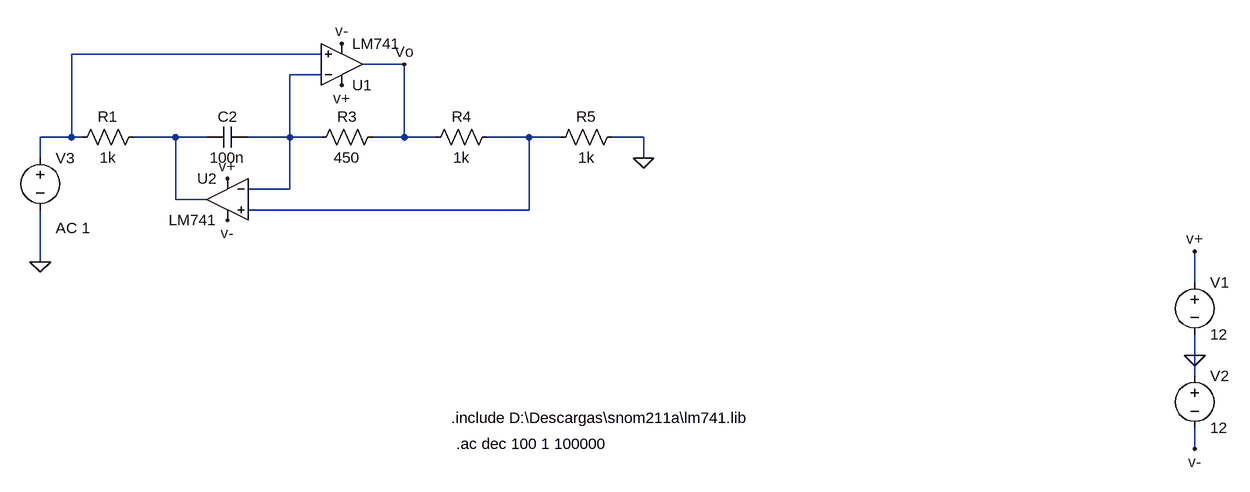
[diagram p0: schematic TS3_gic.asc]
TS3_gic.asc, the LTspice schematic file:
Version 4
SHEET 1 880 680
WIRE -1568 -496 -1952 -496
WIRE -1440 -480 -1504 -480
WIRE -1568 -464 -1616 -464
WIRE -1952 -368 -1952 -496
WIRE -1952 -368 -2000 -368
WIRE -1936 -368 -1952 -368
WIRE -1792 -368 -1856 -368
WIRE -1744 -368 -1792 -368
WIRE -1616 -368 -1616 -464
WIRE -1616 -368 -1680 -368
WIRE -1568 -368 -1616 -368
WIRE -1440 -368 -1440 -480
WIRE -1440 -368 -1488 -368
WIRE -1392 -368 -1440 -368
WIRE -1248 -368 -1312 -368
WIRE -1200 -368 -1248 -368
WIRE -1072 -368 -1120 -368
WIRE -2000 -336 -2000 -368
WIRE -1072 -336 -1072 -368
WIRE -1616 -288 -1616 -368
WIRE -1616 -288 -1680 -288
WIRE -1792 -272 -1792 -368
WIRE -1744 -272 -1792 -272
WIRE -1248 -256 -1248 -368
WIRE -1248 -256 -1680 -256
WIRE -2000 -176 -2000 -256
WIRE -224 -144 -224 -192
WIRE -224 -32 -224 -64
WIRE -224 0 -224 -32
WIRE -224 112 -224 80
FLAG -224 -32 0
FLAG -224 -192 v+
FLAG -224 112 v-
FLAG -1536 -448 v+
FLAG -1536 -512 v-
FLAG -1440 -480 Vo
FLAG -1712 -304 v+
FLAG -1712 -240 v-
FLAG -1072 -336 0
FLAG -2000 -176 0
SYMBOL voltage -224 -160 R0
WINDOW 123 0 0 Left 0
WINDOW 39 0 0 Left 0
SYMATTR InstName V1
SYMATTR Value 12
SYMBOL voltage -224 -16 R0
WINDOW 123 0 0 Left 0
WINDOW 39 0 0 Left 0
SYMATTR InstName V2
SYMATTR Value 12
SYMBOL OpAmps\\opamp2 -1536 -416 M180
SYMATTR InstName U1
SYMATTR Value LM741
SYMBOL voltage -2000 -352 R0
WINDOW 123 24 124 Left 2
WINDOW 39 0 0 Left 0
SYMATTR InstName V3
SYMATTR Value ""
SYMATTR Value2 AC 1
SYMBOL OpAmps\\opamp2 -1712 -336 M0
SYMATTR InstName U2
SYMATTR Value LM741
SYMBOL res -1840 -384 R90
WINDOW 0 0 56 VBottom 2
WINDOW 3 32 56 VTop 2
SYMATTR InstName R1
SYMATTR Value 1k
SYMBOL cap -1680 -384 R90
WINDOW 0 0 32 VBottom 2
WINDOW 3 32 32 VTop 2
SYMATTR InstName C2
SYMATTR Value 100n
SYMBOL res -1472 -384 R90
WINDOW 0 0 56 VBottom 2
WINDOW 3 32 56 VTop 2
SYMATTR InstName R3
SYMATTR Value 450
SYMBOL res -1296 -384 R90
WINDOW 0 0 56 VBottom 2
WINDOW 3 32 56 VTop 2
SYMATTR InstName R4
SYMATTR Value 1k
SYMBOL res -1104 -384 R90
WINDOW 0 0 56 VBottom 2
WINDOW 3 32 56 VTop 2
SYMATTR InstName R5
SYMATTR Value 1k
TEXT -1368 64 Left 2 !.include D:\\Descargas\\snom211a\\lm741.lib
TEXT -1360 104 Left 2 !.ac dec 100 1 100000

The netlist it stands for:
* TS3_gic.asc
V1 v+ 0 12
V2 0 v- 12
XU1 N001 N002 v+ v- Vo LM741  ; pins In+ In- V+ V- OUT
V3 N001 0 AC 1
XU2 N004 N002 v+ v- N003 LM741  ; pins In+ In- V+ V- OUT
R1 N003 N001 1k
C2 N002 N003 100n
R3 Vo N002 450
R4 N004 Vo 1k
R5 0 N004 1k
.include D:\Descargas\snom211a\lm741.lib
.ac dec 100 1 100000
.backanno
.end